# Altium schematic sheet Versterker.SchDoc: Soldeerstation
size A4; DrawnBy: Sem Kirkels; DocumentNumber: 21P001S03; Revision: V1; SheetNumber: 3; SheetTotal: 5
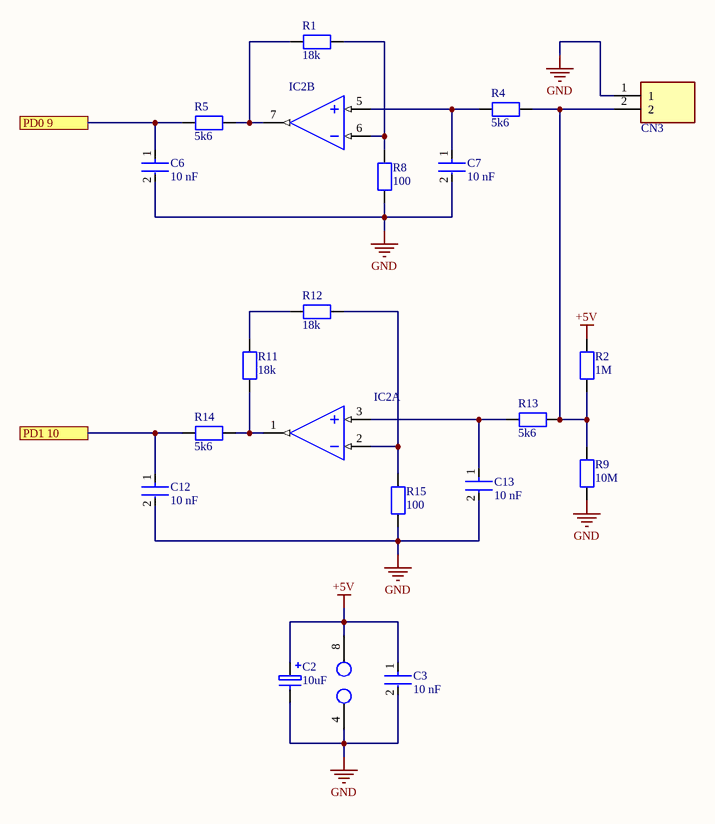
[diagram p0: Versterker.SchDoc]

## Parts
C2  10uF  [Elco 100uF 25V]
C3  10 nF  [0805]
C6  10 nF  [0805]
C7  10 nF  [0805]
C12  10 nF  [0805]
C13  10 nF  [0805]
CN3  282836-2  [2828362]  (value not drawn)
IC2  MCP6002-I/P  [Opamp]  (value not drawn)  (parts A,B of 2)
R1  18k  [0805]
R2  1M  [0805]
R4  5k6  [0805]
R5  5k6  [0805]
R8  100  [0805]
R9  10M  [0805]
R11  18k  [0805]
R12  18k  [0805]
R13  5k6  [0805]
R14  5k6  [0805]
R15  100  [0805]

## Ports
PD0 9, PD1 10

## Nets
+5V: C2.1 C3.1 IC2.8 R2.2
GND: C2.2 C3.2 C6.2 C7.2 C12.2 C13.2 CN3.1 IC2.4 R8.1 R9.1 R15.2
PD0 9: C6.1 R5.1 ; port PD0 9
PD1 10: C12.1 R14.1 ; port PD1 10
NetC7_1: C7.1 IC2.5 R4.1
NetC13_1: C13.1 IC2.3 R13.1
NetCN3_2: CN3.2 R2.1 R4.2 R9.2 R13.2
NetIC2_1: IC2.1 R11.2 R14.2
NetIC2_2: IC2.2 R12.2 R15.1
NetIC2_6: IC2.6 R1.2 R8.2
NetIC2_7: IC2.7 R1.1 R5.2
NetR11_1: R11.1 R12.1

## Library data of the parts
C2 = Condensator Elco: Part Number: 02015A270JAT2A; Manufacturer: AVX Interconnect / Elco
C3 C6 C7 C12 C13 = Condensator 0805: Chip Multilayer Ceramic Capacitors for General Purpose, 0805, 10uF, X5R, 15%, 10%, 25V; Length: 2mm; Depth: 1.25mm; Termination: SMD/SMT; Voltage: 25V; Height: 1.25mm; Material: Ceramic; Thickness: 0.053inch; Radiation Hardening: No; Min Operating Temperature: -55°C; Width: 0.049inch; Package Quantity: 1; Mount: Surface Mount; Dielectric: X5R; Packaging: Tape and Reel; Capacitance: 10uF; Voltage Rating (DC): 25V; Lead Free: Lead Free; Max Operating Temperature: 85°C; Case Code (Imperial): 0805; Case/Package: 0805; Tolerance: 10%; Voltage Rating: 25V; Case Code (Metric): 2012
CN3 = Schroefconnector 2 Pin R: Connector; Manufacturer_Name: TE Connectivity; Datasheet Link: https://www.te.com/commerce/DocumentDelivery/DDEController?Action=showdoc&DocId=Customer+Drawing%7F282836%7FJ%7Fpdf%7FEnglish%7FENG_CD_282836_J.pdf%7F282836-2; Height: 10mm; Manufacturer_Part_Number: 282836-2
IC2 = Opamp: AMP-OPA-MCP6002-IL8; Max Frequency: 1kHz; Operating Supply Current: 100uA; Amplifier Type: GENERAL PURPOSE; Number of Channels: 2; Power Supply Rejection Ratio (PSRR): 86dB; Max Input Voltage: 6V; Bandwidth: 1MHz; Voltage Gain: 112dB; Input Bias Current: 1pA; Slew Rate-Nom: 0.6V/µs; Output Current: 23mA; Input Offset Voltage-Max: 4.5mV; Common Mode Rejection Ratio: 60dB; Min Input Voltage: 1.8V; Operating Supply Voltage: 5.5V; Height: 0.195inch; Number of Circuits: 2; REACH SVHC: No SVHC; Max Supply Voltage: 6V; Supply Current: 100uA; Gain Bandwidth Product: 1MHz; Radiation Hardening: No; Mount: Through Hole; Length: 0.4inch; Number of Pins: 8; Min Operating Temperature: -40°C; Case/Package: PDIP; Number of Amplifiers: 2; RoHS Compliant: Yes; Lead Free: Lead Free; Number of Elements: 2; Technology: CMOS; Width: 0.28inch; Slew Rate: 0.6V/µs; Packaging: Rail/Tube; Output Current per Channel: 23mA; Max Operating Temperature: 85°C; Nominal Supply Current: 100uA; Min Supply Voltage: 1.8V; Input Offset Voltage (Vos): 4.5mV; Unity Gain Bandwidth Product: 1MHz; Package Quantity: 60
R1 R2 R4 R5 R8 R9 R11-R15 = Resistor 0805: Manufacturer: Vishay Dale; Part Number: CRCW08050000Z0EA